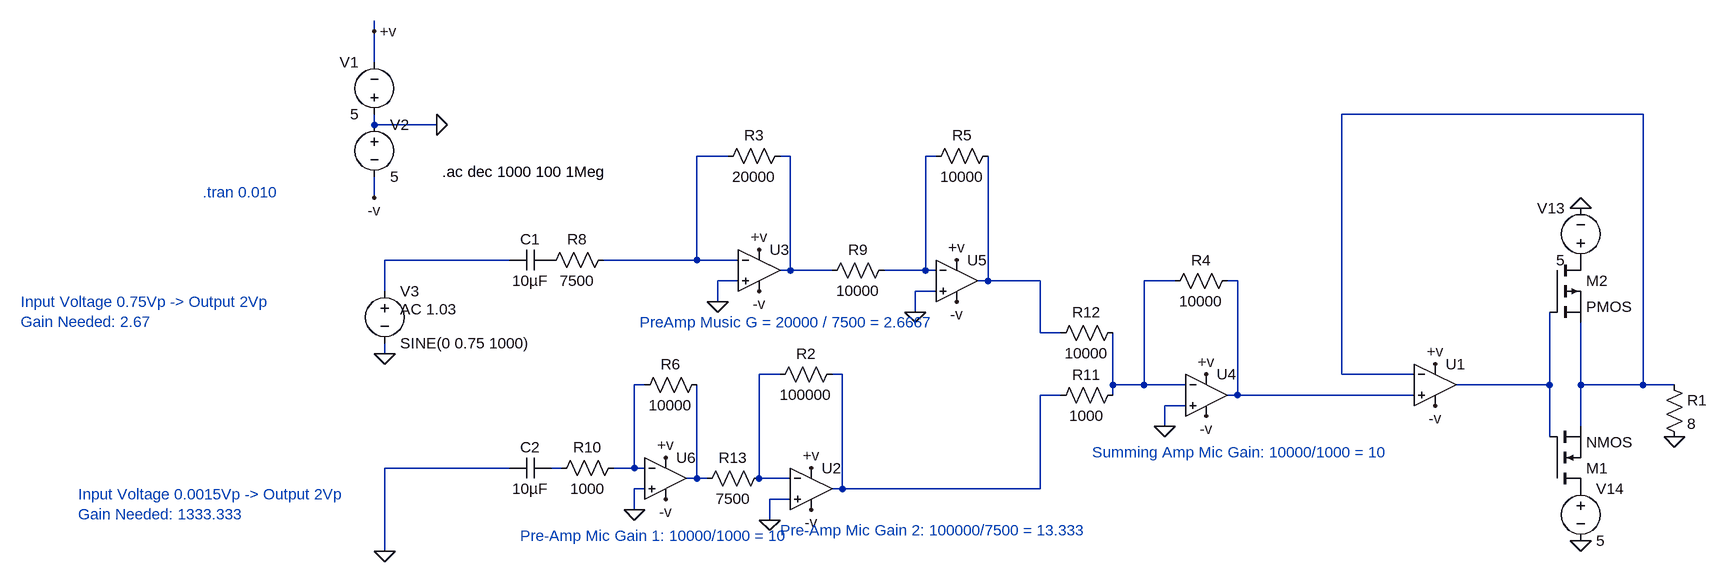
[diagram p0: schematic Draft1.asc]
Draft1.asc, the LTspice schematic file:
Version 4.1
SHEET 1 880 680
WIRE -1712 -528 -1712 -544
WIRE -1712 -480 -1712 -528
WIRE 240 -400 -224 -400
WIRE -1712 -384 -1712 -400
WIRE -1616 -384 -1712 -384
WIRE -1168 -336 -1216 -336
WIRE -1072 -336 -1088 -336
WIRE -848 -336 -864 -336
WIRE -1712 -272 -1712 -304
WIRE -1504 -176 -1696 -176
WIRE -1216 -176 -1216 -336
WIRE -1216 -176 -1360 -176
WIRE -1152 -176 -1216 -176
WIRE -1072 -160 -1072 -336
WIRE -1072 -160 -1088 -160
WIRE -1008 -160 -1072 -160
WIRE -864 -160 -864 -336
WIRE -864 -160 -928 -160
WIRE -848 -160 -864 -160
WIRE -1152 -144 -1184 -144
WIRE -768 -144 -768 -336
WIRE -768 -144 -784 -144
WIRE -688 -144 -768 -144
WIRE -480 -144 -528 -144
WIRE -384 -144 -400 -144
WIRE -1696 -128 -1696 -176
WIRE -848 -128 -880 -128
WIRE -1184 -112 -1184 -144
WIRE -880 -96 -880 -128
WIRE -688 -64 -688 -144
WIRE -656 -64 -688 -64
WIRE -1696 -32 -1696 -48
WIRE -1088 0 -1120 0
WIRE -992 0 -1008 0
WIRE -224 0 -224 -400
WIRE -112 0 -224 0
WIRE -1296 16 -1312 16
WIRE -576 16 -576 -64
WIRE -528 16 -528 -144
WIRE -528 16 -576 16
WIRE -464 16 -528 16
WIRE 96 16 96 -96
WIRE 96 16 -48 16
WIRE 144 16 144 -80
WIRE 240 16 240 -400
WIRE 240 16 144 16
WIRE 288 16 240 16
WIRE -656 32 -688 32
WIRE -576 32 -576 16
WIRE -384 32 -384 -144
WIRE -384 32 -400 32
WIRE -112 32 -384 32
WIRE -464 48 -496 48
WIRE -496 80 -496 48
WIRE 144 80 144 16
WIRE 96 96 96 16
WIRE -1504 144 -1696 144
WIRE -1424 144 -1440 144
WIRE -1312 144 -1312 16
WIRE -1312 144 -1344 144
WIRE -1296 144 -1312 144
WIRE -1216 160 -1216 16
WIRE -1216 160 -1232 160
WIRE -1200 160 -1216 160
WIRE -1120 160 -1120 0
WIRE -1072 160 -1120 160
WIRE -1296 176 -1312 176
WIRE -992 176 -992 0
WIRE -992 176 -1008 176
WIRE -688 176 -688 32
WIRE -688 176 -992 176
WIRE -1072 192 -1104 192
WIRE -1312 208 -1312 176
WIRE -1104 224 -1104 192
WIRE -1696 272 -1696 144
FLAG 144 256 0
FLAG 144 -256 0
FLAG 288 96 0
FLAG -496 80 0
FLAG -1312 208 0
FLAG -880 -96 0
FLAG -1696 -32 0
FLAG -1696 272 0
FLAG -1184 -112 0
FLAG -1104 224 0
FLAG -1616 -384 0
FLAG -1712 -528 +v
FLAG -1120 -192 +v
FLAG -1264 128 +v
FLAG -1040 144 +v
FLAG -432 0 +v
FLAG -80 -16 +v
FLAG -1712 -272 -v
FLAG -1120 -128 -v
FLAG -1040 208 -v
FLAG -1264 192 -v
FLAG -432 64 -v
FLAG -80 48 -v
FLAG -816 -176 +v
FLAG -816 -112 -v
SYMBOL OpAmps\\UniversalOpAmp -80 16 R0
SYMATTR InstName U1
SYMBOL OpAmps\\UniversalOpAmp -432 32 R0
SYMATTR InstName U4
SYMBOL OpAmps\\UniversalOpAmp -816 -144 R0
SYMATTR InstName U5
SYMBOL OpAmps\\UniversalOpAmp -1264 160 R0
SYMATTR InstName U6
SYMBOL nmos 96 176 M180
SYMATTR InstName M1
SYMBOL pmos 96 -176 R0
SYMATTR InstName M2
SYMBOL voltage 144 -160 R180
WINDOW 0 24 96 Left 2
WINDOW 3 24 16 Left 2
WINDOW 123 0 0 Left 0
WINDOW 39 0 0 Left 0
SYMATTR InstName V13
SYMATTR Value 5
SYMBOL voltage 144 160 R0
WINDOW 123 0 0 Left 0
WINDOW 39 0 0 Left 0
SYMATTR InstName V14
SYMATTR Value 5
SYMBOL res 272 0 R0
SYMATTR InstName R1
SYMATTR Value 8
SYMBOL res -384 -160 R90
WINDOW 0 0 56 VBottom 2
WINDOW 3 32 56 VTop 2
SYMATTR InstName R4
SYMATTR Value 10000
SYMBOL res -752 -352 R90
WINDOW 0 0 56 VBottom 2
WINDOW 3 32 56 VTop 2
SYMATTR InstName R5
SYMATTR Value 10000
SYMBOL res -1200 0 R90
WINDOW 0 0 56 VBottom 2
WINDOW 3 32 56 VTop 2
SYMATTR InstName R6
SYMATTR Value 10000
SYMBOL res -1344 -192 R90
WINDOW 0 0 56 VBottom 2
WINDOW 3 32 56 VTop 2
SYMATTR InstName R8
SYMATTR Value 7500
SYMBOL cap -1440 -192 R90
WINDOW 0 0 32 VBottom 2
WINDOW 3 32 32 VTop 2
SYMATTR InstName C1
SYMATTR Value 10µF
SYMBOL cap -1440 128 R90
WINDOW 0 0 32 VBottom 2
WINDOW 3 32 32 VTop 2
SYMATTR InstName C2
SYMATTR Value 10µF
SYMBOL res -560 16 R90
WINDOW 0 0 56 VBottom 2
WINDOW 3 32 56 VTop 2
SYMATTR InstName R11
SYMATTR Value 1000
SYMBOL res -560 -80 R90
WINDOW 0 0 56 VBottom 2
WINDOW 3 32 56 VTop 2
SYMATTR InstName R12
SYMATTR Value 10000
SYMBOL OpAmps\\UniversalOpAmp -1120 -160 R0
SYMATTR InstName U3
SYMBOL res -1072 -352 R90
WINDOW 0 0 56 VBottom 2
WINDOW 3 32 56 VTop 2
SYMATTR InstName R3
SYMATTR Value 20000
SYMBOL res -912 -176 R90
WINDOW 0 0 56 VBottom 2
WINDOW 3 32 56 VTop 2
SYMATTR InstName R9
SYMATTR Value 10000
SYMBOL OpAmps\\UniversalOpAmp -1040 176 R0
SYMATTR InstName U2
SYMBOL res -992 -16 R90
WINDOW 0 0 56 VBottom 2
WINDOW 3 32 56 VTop 2
SYMATTR InstName R2
SYMATTR Value 100000
SYMBOL res -1328 128 R90
WINDOW 0 0 56 VBottom 2
WINDOW 3 32 56 VTop 2
SYMATTR InstName R10
SYMATTR Value 1000
SYMBOL res -1104 144 R90
WINDOW 0 0 56 VBottom 2
WINDOW 3 32 56 VTop 2
SYMATTR InstName R13
SYMATTR Value 7500
SYMBOL voltage -1712 -384 R180
WINDOW 0 24 96 Left 2
WINDOW 3 24 16 Left 2
WINDOW 123 0 0 Left 0
WINDOW 39 0 0 Left 0
SYMATTR InstName V1
SYMATTR Value 5
SYMBOL voltage -1712 -400 R0
WINDOW 123 0 0 Left 0
WINDOW 39 0 0 Left 0
SYMATTR InstName V2
SYMATTR Value 5
SYMBOL voltage -1696 -144 R0
WINDOW 123 24 44 Left 2
WINDOW 39 0 0 Left 0
SYMATTR Value2 AC 1.03
SYMATTR InstName V3
SYMATTR Value SINE(0 0.75 1000)
TEXT -2256 -112 Left 2 ;Input Voltage 0.75Vp -> Output 2Vp\nGain Needed: 2.67
TEXT -2168 184 Left 2 ;Input Voltage 0.0015Vp -> Output 2Vp\nGain Needed: 1333.333
TEXT -1304 -80 Left 2 ;PreAmp Music G = 20000 / 7500 = 2.6667
TEXT -1488 248 Left 2 ;Pre-Amp Mic Gain 1: 10000/1000 = 10
TEXT -1088 240 Left 2 ;Pre-Amp Mic Gain 2: 100000/7500 = 13.333
TEXT -608 120 Left 2 ;Summing Amp Mic Gain: 10000/1000 = 10
TEXT -1976 -280 Left 2 ;.tran 0.010
TEXT -1608 -312 Left 2 !.ac dec 1000 100 1Meg

The netlist it stands for:
* Draft1.asc
X§U1 N008 N001 +v -v N012 level1 Avol=1Meg GBW=10Meg Vos=0 En=0 Enk=0 In=0 Ink=0 Rin=500Meg  ; pins In+ In- V+ V- OUT
X§U4 0 N007 +v -v N008 level1 Avol=1Meg GBW=10Meg Vos=0 En=0 Enk=0 In=0 Ink=0 Rin=500Meg  ; pins In+ In- V+ V- OUT
X§U5 0 N004 +v -v N006 level1 Avol=1Meg GBW=10Meg Vos=0 En=0 Enk=0 In=0 Ink=0 Rin=500Meg  ; pins In+ In- V+ V- OUT
X§U6 0 N011 +v -v N014 level1 Avol=1Meg GBW=10Meg Vos=0 En=0 Enk=0 In=0 Ink=0 Rin=500Meg  ; pins In+ In- V+ V- OUT
M1 P001 N012 N001 N001 NMOS
M2 P002 N012 N001 N001 PMOS
V13 P002 0 5
V14 P001 0 5
R1 N001 0 8
R4 N008 N007 10000
R5 N006 N004 10000
R6 N014 N011 10000
R8 N002 P003 7500
C1 P003 N005 10µF
C2 N013 0 10µF
R11 N007 N010 1000
R12 N007 N006 10000
X§U3 0 N002 +v -v N003 level1 Avol=1Meg GBW=10Meg Vos=0 En=0 Enk=0 In=0 Ink=0 Rin=500Meg  ; pins In+ In- V+ V- OUT
R3 N003 N002 20000
R9 N004 N003 10000
X§U2 0 N009 +v -v N010 level1 Avol=1Meg GBW=10Meg Vos=0 En=0 Enk=0 In=0 Ink=0 Rin=500Meg  ; pins In+ In- V+ V- OUT
R2 N010 N009 100000
R10 N011 N013 1000
R13 N009 N014 7500
V1 0 +v 5
V2 0 -v 5
V3 N005 0 SINE(0 0.75 1000) AC 1.03
.model NMOS NMOS
.model PMOS PMOS
.lib standard.mos
* Input Voltage 0.75Vp -> Output 2Vp
* Gain Needed: 2.67
* Input Voltage 0.0015Vp -> Output 2Vp
* Gain Needed: 1333.333
* PreAmp Music G = 20000 / 7500 = 2.6667
* Pre-Amp Mic Gain 1: 10000/1000 = 10
* Pre-Amp Mic Gain 2: 100000/7500 = 13.333
* Summing Amp Mic Gain: 10000/1000 = 10
* .tran 0.010
.ac dec 1000 100 1Meg
.lib UniversalOpAmp1.lib
.backanno
.end